# EasyEDA schematic SCH_nodemcu_stepper_2023-12-21.json
TITLE: 3D Scanner Stepper; REV: 1.0; Date: 2022-12-19; Sheet: 1/1; Drawn By: Wilhelm Schütze; Company: InMachines Ingrassia GmbH
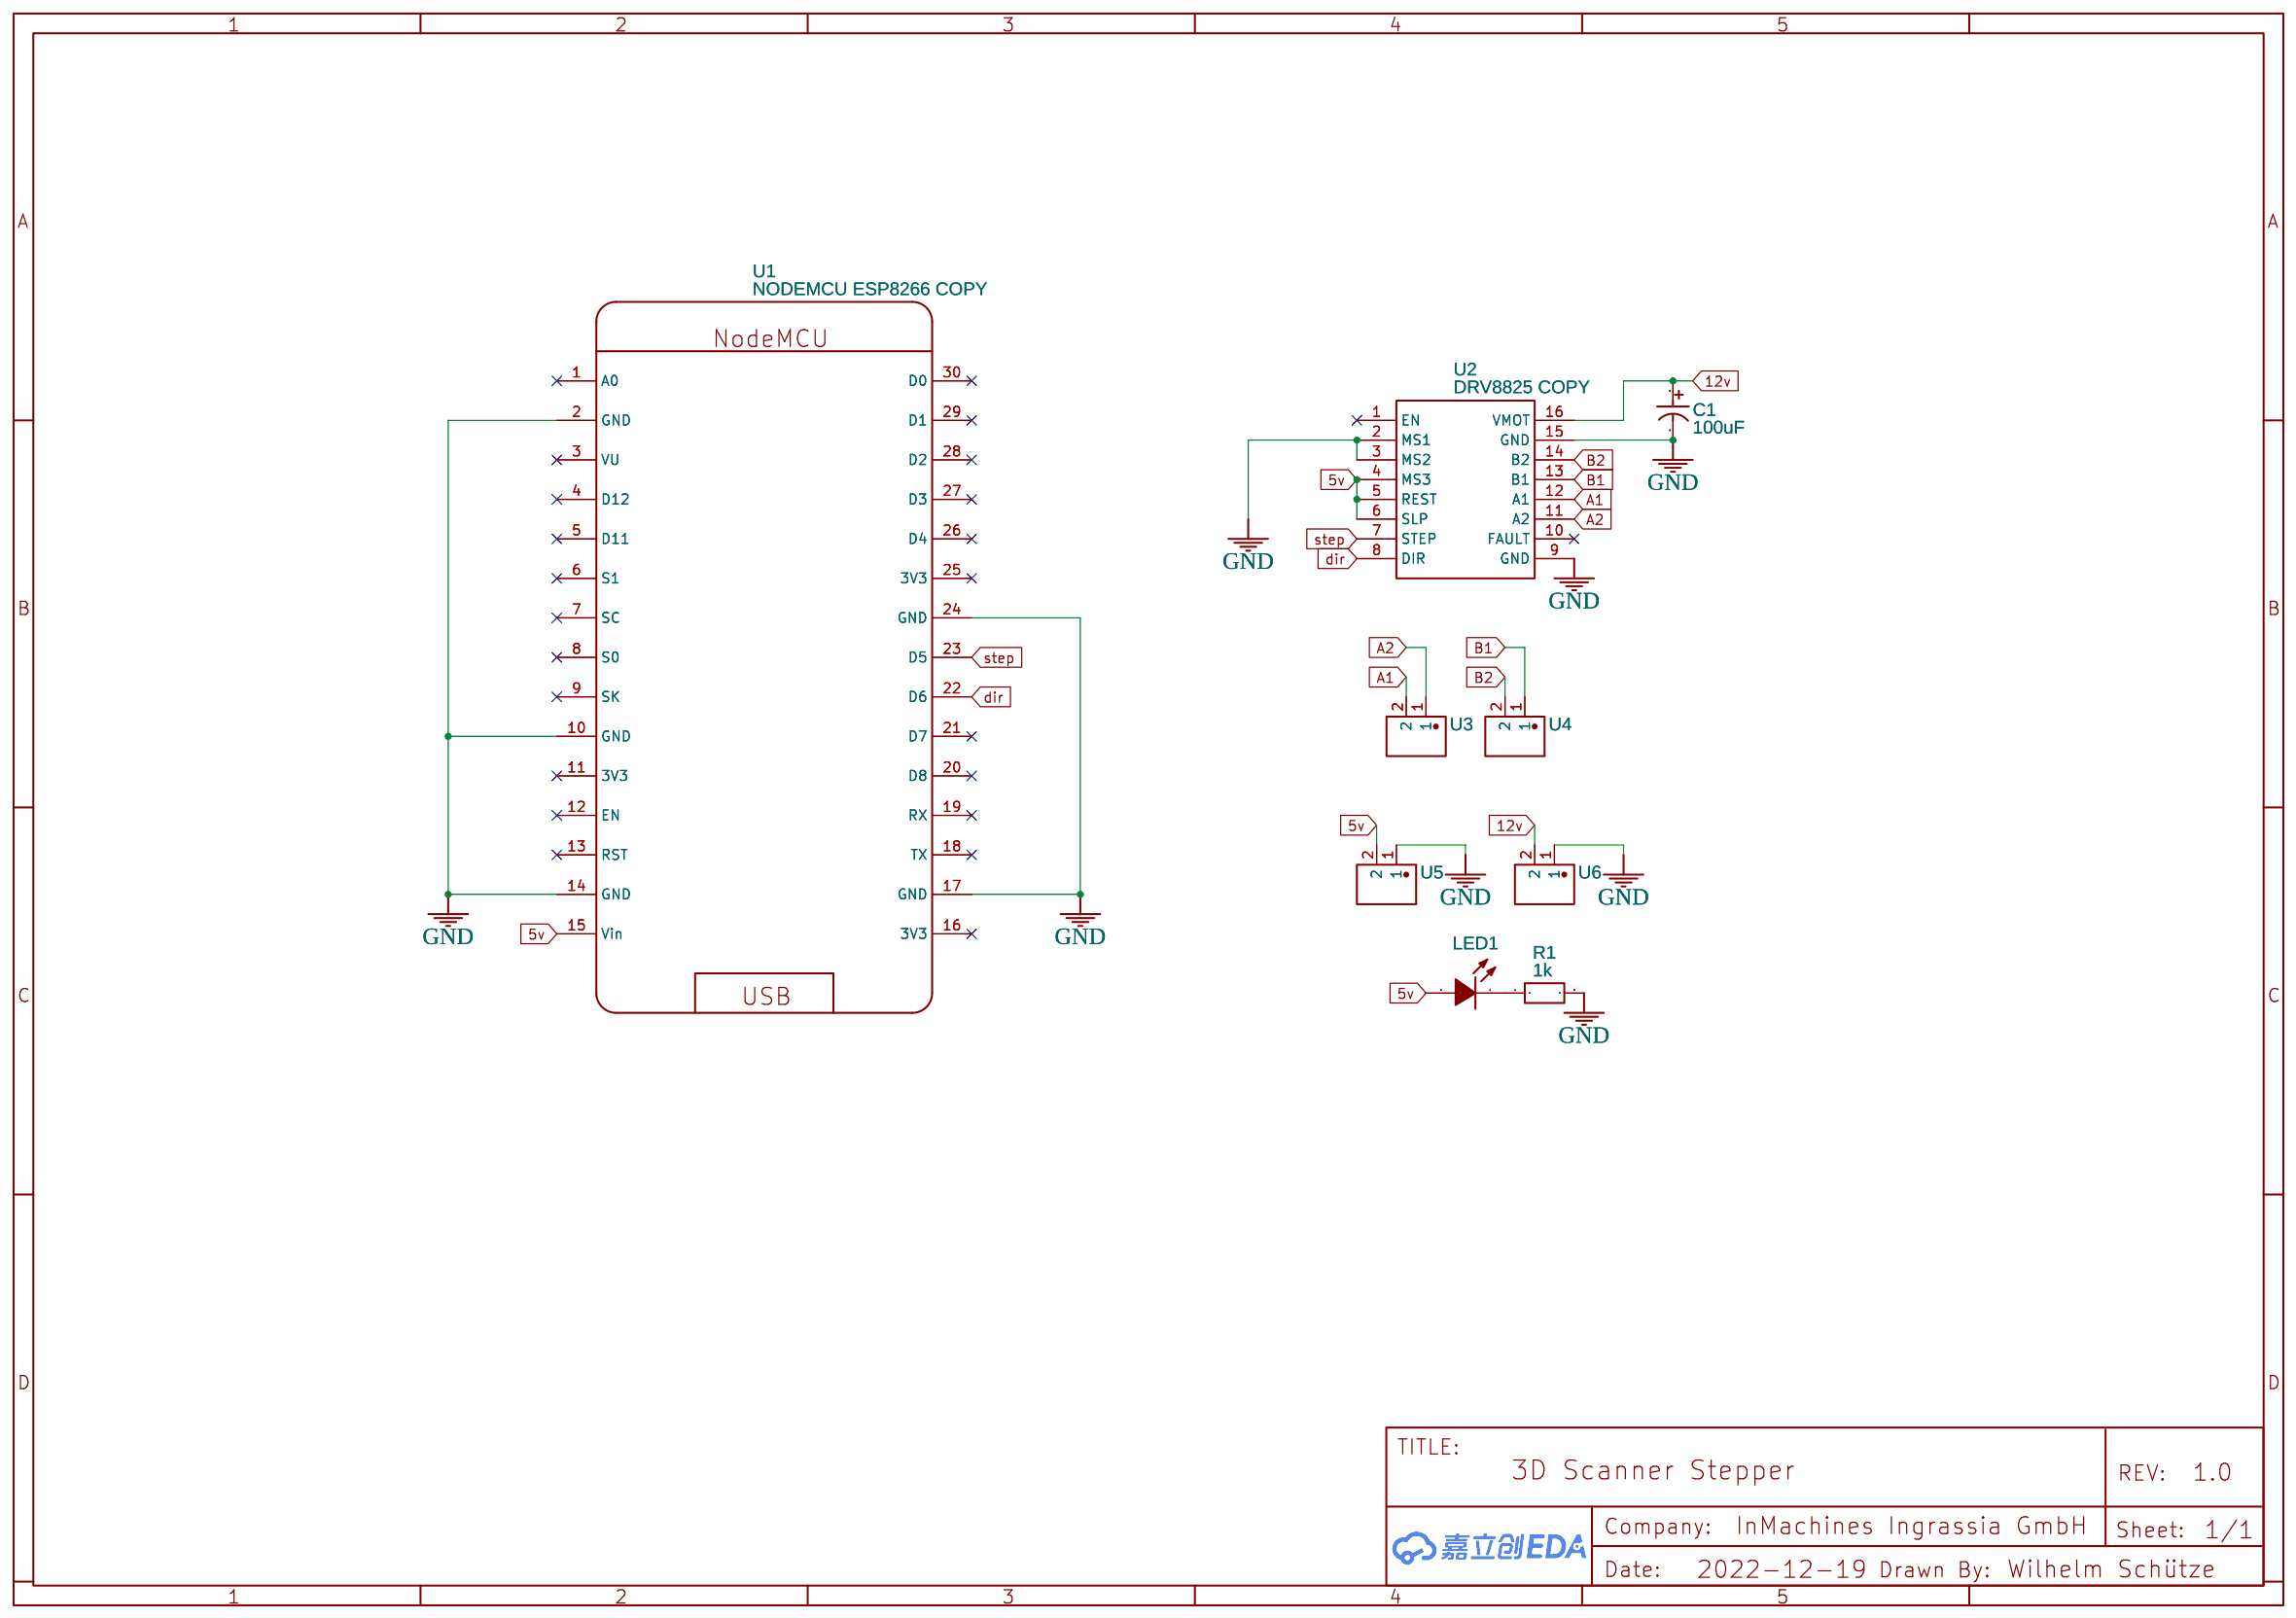
[diagram p0: schematic sheet]

## Parts
C1  100uF  [100UF-35V-KONDANSATOR]
LED1  1206 LED Fab Lab UCAL  [LED 1206]
R1  1k  [R1206]
U1  NODEMCU ESP8266 COPY  [NODEMCU]
U2  DRV8825 COPY  [DRV8825]
U3  DB128L-5.08-2P-GN-P  [CONN-TH_2P-P5.08_DB128L-5.08-2P-GN-P]
U4  DB128L-5.08-2P-GN-P  [CONN-TH_2P-P5.08_DB128L-5.08-2P-GN-P]
U5  DB128L-5.08-2P-GN-P  [CONN-TH_2P-P5.08_DB128L-5.08-2P-GN-P]
U6  DB128L-5.08-2P-GN-P  [CONN-TH_2P-P5.08_DB128L-5.08-2P-GN-P]

## Library data of the parts
C1 = 100UF-35V-KONDANSATOR: Supplier: LCSC; Manufacturer: ROQANG; Manufacturer Part: RVE1V101M0607; Supplier Part: C99837
LED1 = 1206 LED Fab Lab UCAL: Supplier Part: 1206; Supplier: LCSC; Manufacturer: KENTO; Manufacturer Part: 1206 LED; image: //image.lceda.cn/szlcsc/C49018.jpg; Contributor: Willy Schütze
R1 = R_1206_EU: Contributor: LCEDA_Lib
U1 = NODEMCU ESP8266 COPY: Contributor: Byte Electronics
U2 = DRV8825 COPY: Contributor: philipp_6728
U3-U6 = DB128L-5.08-2P-GN-P: Supplier: LCSC; Supplier Part: C430600; Manufacturer: DIBO(地博电气); Contributor: LCSC; JLCPCB Part Class: Extended Part

## Nets
5v: LED1.2(A) U1.15(Vin) U2.4(MS3) U2.5(REST) U2.6(SLP) U5.2
12v: C1.1 U2.16(VMOT) U6.2
GND: C1.2 R1.2 U1.2(GND) U1.10(GND) U1.14(GND) U1.17(GND) U1.24(GND) U2.2(MS1) U2.3(MS2) U2.9(GND) U2.15(GND) U5.1 U6.1
A1: U2.12(A1) U3.2
A2: U2.11(A2) U3.1
B1: U2.13(B1) U4.1
B2: U2.14(B2) U4.2
dir: U1.22(D6) U2.8(DIR)
step: U1.23(D5) U2.7(STEP)
Net-(LED1-1): LED1.1(K) R1.1

Not connected (* = marked no-connect by the designer): U1 1(A0)* 3(VU)* 4(D12)* 5(D11)* 6(S1)* 7(SC)* 8(S0)* 9(SK)* 11(3V3)* 12(EN)* 13(RST)* 16(3V3)* 18(TX)* 19(RX)* 20(D8)* 21(D7)* 25(3V3)* 26(D4)* 27(D3)* 28(D2)* 29(D1)* 30(D0)*; U2 1(EN)* 10(FAULT)*
